# EAGLE design IceFeildBoard (EAGLE 8.6.0)
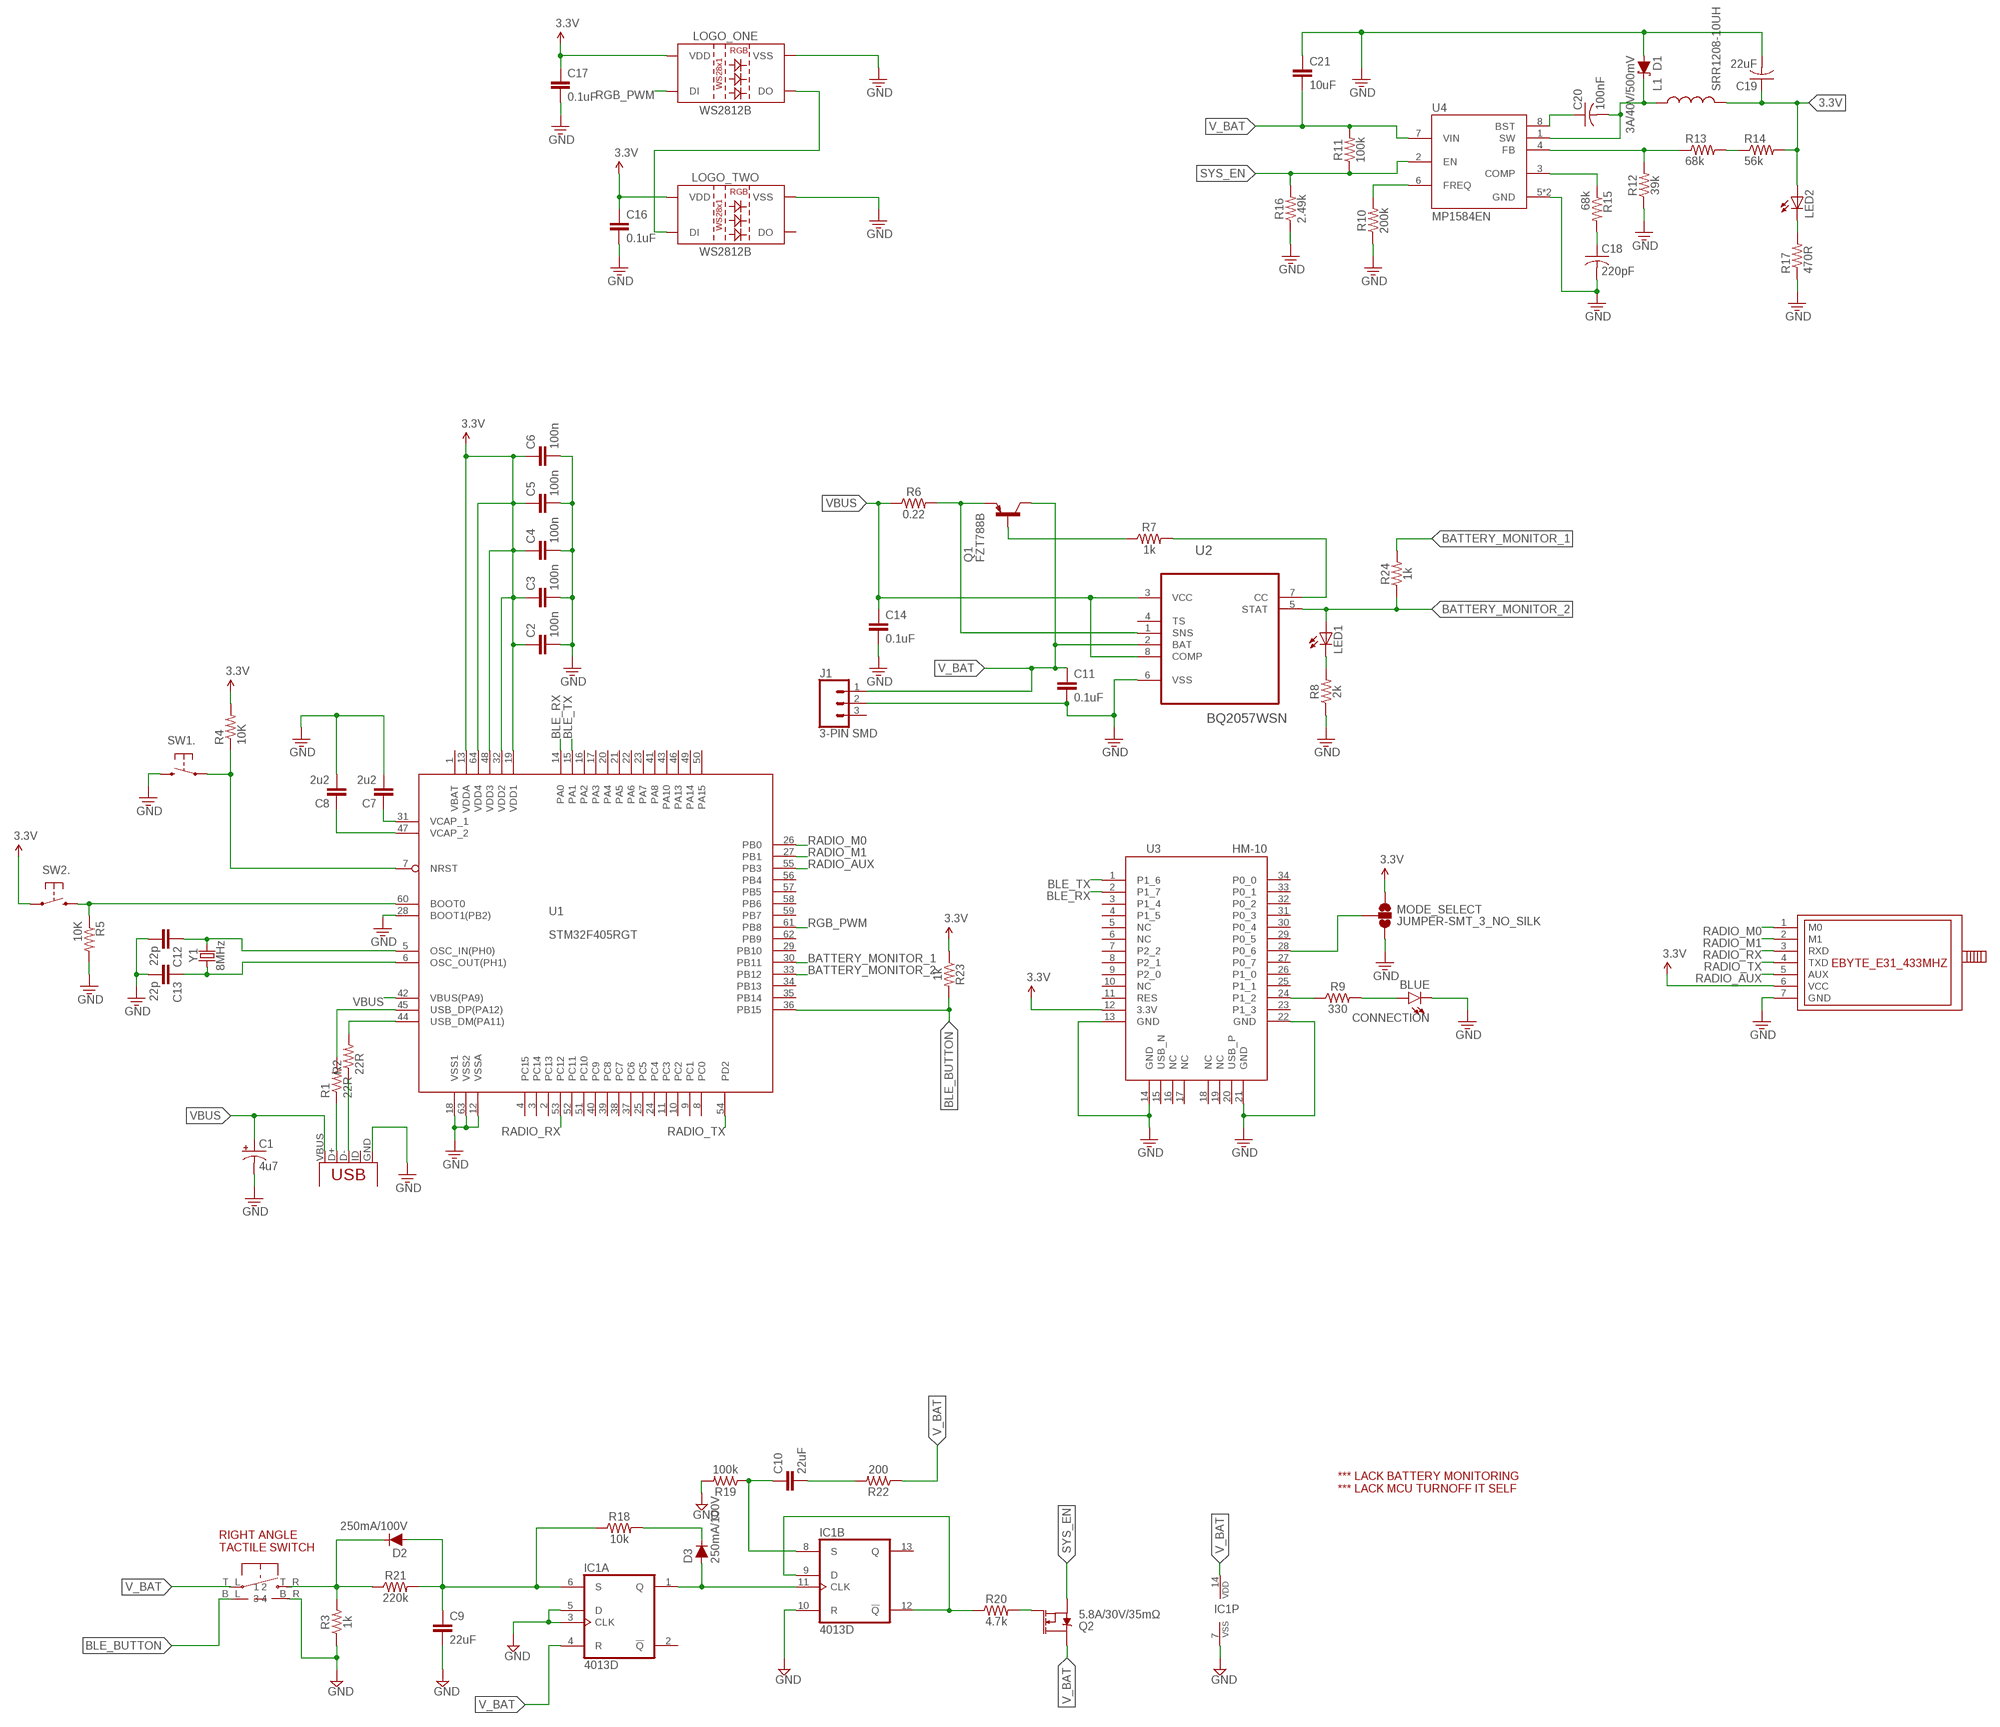
[diagram p0: schematic, sheet 1]

## Parts
C1  4u7  CAP_POL1206-KIT  [EIA3216-KIT]
C2  100n  CAP0603-CAP  [0603-CAP]
C3  100n  CAP0603-CAP  [0603-CAP]
C4  100n  CAP0603-CAP  [0603-CAP]
C5  100n  CAP0603-CAP  [0603-CAP]
C6  100n  CAP0603-CAP  [0603-CAP]
C7  2u2  CAP0603-CAP  [0603-CAP]
C8  2u2  CAP0603-CAP  [0603-CAP]
C9  22uF  22UF-0805-6.3V-20%  [0805]
C10  22uF  22UF-0805-6.3V-20%  [0805]
C11  0.1uF  0.1UF-0603-25V-(+80/-20%)  [0603]
C12  22p  CAP0603-CAP  [0603-CAP]
C13  22p  CAP0603-CAP  [0603-CAP]
C14  0.1uF  0.1UF-0603-25V-(+80/-20%)  [0603]
C16  0.1uF  0.1UF-0603-25V-5%  [0603]
C17  0.1uF  0.1UF-0603-25V-5%  [0603]
C18  220pF  C-USC0603  [C0603]
C19  22uF  C-USC0603  [C0603]
C20  100nF  C-USC0603  [C0603]
C21  10uF  10UF-0603-6.3V-20%  [0603]
CONNECTION  BLUE  LED-BLUE0603  [LED-0603]
D1  3A/40V/500mV  DIODE-SCHOTTKY-B340A  [SMA-DIODE]
D2  250mA/100V  DIODE-BAS16J  [SOD-323]
D3  250mA/100V  DIODE-BAS16J  [SOD-323]
IC1  4013D  [SO14]
J1  3-PIN SMD  CONN_03JST-SMD  [JST-3-SMD]
L1  SRR1208-10UH  [1008]
LED1  LED0603  [LED-0603]
LED2  LED0603  [LED-0603]
LOGO_ONE  WS2812B  [WS2812B]
LOGO_TWO  WS2812B  [WS2812B]
MODE_SELECT  JUMPER-SMT_3_NO_SILK  [SMT-JUMPER_3_NO_SILK]
Q1  FZT788B  [SOT230P700X180-4N]
Q2  5.8A/30V/35mΩ  MOSFET-NCH-AO3404A  [SOT23-3]
R1  22R  RESISTOR0603-RES  [0603-RES]
R2  22R  RESISTOR0603-RES  [0603-RES]
R3  1k  1KOHM-0603-1/10W-1%  [0603]
R4  10K  RESISTOR0603-RES  [0603-RES]
R5  10K  RESISTOR0603-RES  [0603-RES]
R6  0.22  0.22OHM-0805-1/4W-1%  [0805]
R7  1k  1KOHM-0603-1/10W-1%  [0603]
R8  2k  RESISTOR0603  [0603]
R9  330  330OHM-0603-1/10W-1%  [0603]
R10  200k  200KOHM-0603-1/10W-1%  [0603]
R11  100k  100KOHM-0603-1/10W-1%  [0603]
R12  39k  39KOHM-0603-1/10W-1%  [0603]
R13  68k  R-US_R0603  [R0603]
R14  56k  R-US_R0603  [R0603]
R15  68k  R-US_R0603  [R0603]
R16  2.49k  2.49KOHM-0603-1/10W-1%  [0603]
R17  470R  RESISTOR0603-RES  [0603-RES]
R18  10k  10KOHM-0603-1/10W-1%  [0603]
R19  100k  100KOHM-0603-1/10W-1%  [0603]
R20  4.7k  4.7KOHM-0603-1/10W-1%  [0603]
R21  220k  220KOHM-0603-1/10W-1%  [0603]
R22  200  200OHM-0603-1/10W-1%  [0603]
R23  1k  1KOHM-0603-1/10W-1%  [0603]
R24  1k  1KOHM-0603-1/10W-1%  [0603]
SW1  !RST  SWITCH-B3U-1110-BOSS  [SWITCH-TACT-B3U-1100P-B]
SW2  BOOT  SWITCH-B3U-1110-BOSS  [SWITCH-TACT-B3U-1100P-B]
U1  STM32F405RGT  [LQFP64]
U2  BQ2057WSN  [SOIC127P600X175-8N]
U3  HM-10  [HM-10]
U4  MP1584EN  [SOIC9P127_490X600X170L84X42T330X241N]
U$1  RIGHT_ANGLE_TACTILE_SWITCH  [RIGHT_ANGLE_TACTILE_SWITCH]
U$2  EBYTE_E31_433MHZ  [EBYTE_E31_433MHZ]
USB  USB-MICROB-SMD  [USB-MICROB-SMD]
Y1  8MHz  CRYSTAL-8MHZSMD-5X3.2  [CRYSTAL-SMD-5X3.2-4PAD]

## Nets
3.3V: C2.1 C3.1 C4.1 C5.1 C6.1 C16.1 C17.1 C19.1 L1.2 LED2.A LOGO_ONE.1(VDD) LOGO_TWO.1(VDD) MODE_SELECT.1 R4.2 R14.2 R23.1 SW2.1 U1.13(VDDA) U1.19(VDD1) U1.32(VDD2) U1.48(VDD3) U1.64(VDD4) U3.12(3.3V) U$2.6(VCC)
BATTERY_MONITOR_1 [Signal]: R24.2 U1.30(PB11)
BATTERY_MONITOR_2 [Signal]: LED1.A R24.1 U1.33(PB12) U2.5(STAT)
BLE_BUTTON: R23.2 U1.36(PB15) U$1.B_L
BLE_RX [Signal]: U1.14(PA0) U3.2(P1_7)
BLE_TX [Signal]: U1.15(PA1) U3.1(P1_6)
GND: C1.C(-) C2.2 C3.2 C4.2 C5.2 C6.2 C7.2 C8.2 C9.2 C11.2 C12.2 C13.2 C14.2 C16.2 C17.2 C18.2 C19.2 C21.1 CONNECTION.C D1.A IC1.3(A:CLK) IC1.5(A:D) IC1.7(P:VSS) IC1.10(B:R) J1.2 LOGO_ONE.3(VSS) LOGO_TWO.3(VSS) MODE_SELECT.3 R3.1 R5.2 R8.1 R10.1 R12.1 R16.1 R17.1 R19.2 SW1.2 U1.12(VSSA) U1.18(VSS1) U1.28(BOOT1(PB2)) U1.63(VSS2) U2.6(VSS) U3.13(GND) U3.14(GND) U3.21(GND) U3.22(GND) U4.5(GND) U4.9(GND) U$1.B_R U$2.7(GND) USB.GND
N$1: R1.2 U1.45(USB_DP(PA12))
N$2: R2.2 U1.44(USB_DM(PA11))
N$4 [Radio]: C14.1 R6.1 U2.3(VCC) U2.8(COMP)
N$5: R1.1 USB.D+
N$6: R2.1 USB.D-
N$7: CONNECTION.A R9.2
N$8: C9.1 D2.A IC1.6(A:S) R18.1 R21.2
N$9: R9.1 U3.24(P1_2)
N$10: MODE_SELECT.2 U3.28(P0_6)
N$11: LOGO_ONE.2(DO) LOGO_TWO.4(DI)
N$12: C13.1 U1.6(OSC_OUT(PH1)) Y1.1
N$13: C7.1 U1.31(VCAP_1)
N$14: C8.1 U1.47(VCAP_2)
N$15: C12.1 U1.5(OSC_IN(PH0)) Y1.3
N$16 [Signal]: R5.1 SW2.2 U1.60(BOOT0)
N$17 [Signal]: R4.1 SW1.1 U1.7(NRST)
N$18 [Radio]: Q1.3(E) R6.2 U2.1(SNS)
N$19 [Radio]: Q1.1(B) R7.1
N$20: R13.2 R14.1
N$21: D2.C R3.2 R21.1 U$1.T_R
N$22: R12.2 R13.1 U4.4(FB)
N$23 [Power]: C20.2 D1.C L1.1 U4.1(SW)
N$24 [Power]: C20.1 U4.8(BST)
N$25: LED2.C R17.2
N$26: D3.A IC1.1(A:Q) IC1.11(B:CLK)
N$27: D3.C R18.2
N$28: R15.1 U4.3(COMP)
N$29: C18.1 R15.2
N$30: IC1.9(B:D) IC1.12(B:!Q) R20.1
N$31: C10.1 IC1.8(B:S) R19.1
N$32: R10.2 U4.6(FREQ)
N$33: Q2.1(G) R20.2
N$34: R7.2 U2.7(CC)
N$35: C10.2 R22.2
N$37: LED1.C R8.2
RADIO_AUX: U1.55(PB3) U$2.5(AUX)
RADIO_M0: U1.26(PB0) U$2.1(M0)
RADIO_M1: U1.27(PB1) U$2.2(M1)
RADIO_RX: U1.53(PC12) U$2.3(RXD)
RADIO_TX: U1.54(PD2) U$2.4(TXD)
RGB_PWM [Signal]: LOGO_ONE.4(DI) U1.61(PB8)
SYS_EN: Q2.2(S) R11.1 R16.2 U4.2(EN)
V_BAT: C11.1 C21.2 IC1.4(A:R) IC1.14(P:VDD) J1.1 Q1.2(C) Q1.4(C) Q2.3(D) R11.2 R22.1 U2.2(BAT) U4.7(VIN) U$1.T_L
VBUS: C1.A(+) U1.42(VBUS(PA9)) USB.VBUS
Unconnected: IC1.2(A:!Q) IC1.13(B:Q) J1.3 LOGO_TWO.2(DO) SW1.BOSS SW2.BOSS U1.2(PC13) U1.3(PC14) U1.4(PC15) U1.8(PC0) U1.9(PC1) U1.10(PC2) U1.11(PC3) U1.16(PA2) U1.17(PA3) U1.20(PA4) U1.21(PA5) U1.22(PA6) U1.23(PA7) U1.24(PC4) U1.25(PC5) U1.29(PB10) U1.34(PB13) U1.35(PB14) U1.37(PC6) U1.38(PC7) U1.39(PC8) U1.40(PC9) U1.41(PA8) U1.43(PA10) U1.46(PA13) U1.49(PA14) U1.50(PA15) U1.51(PC10) U1.52(PC11) U1.56(PB4) U1.57(PB5) U1.58(PB6) U1.59(PB7) U1.62(PB9) U2.4(TS) U3.3(P1_4) U3.4(P1_5) U3.5(NC) U3.6(NC) U3.7(P2_2) U3.8(P2_1) U3.9(P2_0) U3.10(NC) U3.11(RES) U3.15(USB_N) U3.16(NC) U3.17(NC) U3.18(NC) U3.19(NC) U3.20(USB_P) U3.23(P1_3) U3.25(P1_1) U3.26(P1_0) U3.27(P0_7) U3.29(P0_5) U3.30(P0_4) U3.31(P0_3) U3.32(P0_2) U3.33(P0_1) U3.34(P0_0) USB.ID USB.MT1 USB.MT2 USB.MT3 USB.MT4

## Notes on the sheet
- *** LACK BATTERY MONITORING 
  *** LACK MCU TURNOFF IT SELF

## Power pins joined to a net without a drawn wire
VBAT: U1.1(VBAT)

## Library data of the parts
C1 = stm32f4stamp:CAP_POL: Capacitor Polarized These are standard SMD and PTH capacitors. Normally 10uF, 47uF, and 100uF in electrolytic and tantalum varieties. Always verify the external diameter of the through hole cap, it varies with capacity, voltage, and manufacturer. The EIA devices should be standard.; OC_NEWARK: unknown
C2-C8 C12 C13 = stm32f4stamp:CAP: Capacitor Standard 0603 ceramic capacitor, and 0.1" leaded capacitor.; OC_NEWARK: unknown
C9 C10 = SparkFun-Capacitors:22UF: 22µF ceramic capacitors A capacitor is a passive two-terminal electrical component used to store electrical energy temporarily in an electric field.; OC_NEWARK: unknown; PROD_ID: CAP-08402
C11 C14 = SparkFun-Capacitors:0.1UF: 0.1µF ceramic capacitors A capacitor is a passive two-terminal electrical component used to store electrical energy temporarily in an electric field.; OC_NEWARK: unknown; PROD_ID: CAP-00810
C16 C17 = SparkFun-Capacitors:0.1UF: 0.1µF ceramic capacitors A capacitor is a passive two-terminal electrical component used to store electrical energy temporarily in an electric field.; OC_NEWARK: unknown; PROD_ID: CAP-08604
C18-C20 = adafruit:C-US: CAPACITOR, American symbol; OC_NEWARK: unknown
C21 = SparkFun-Capacitors:10UF: 10.0µF ceramic capacitors A capacitor is a passive two-terminal electrical component used to store electrical energy temporarily in an electric field.; OC_NEWARK: unknown; PROD_ID: CAP-11015
CONNECTION = SparkFun-LED:LED-BLUE: Blue SMD LED Used in manufacturing of various products at SparkFun Packages: 0603 - SMD 0603 package [Product Link] <http://www.digikey.com/product-detail/en/SMLE12BC7TT86/511-1589-2-ND/1641808> 1206 - SMD1206 package [Product Link] <http://www.digikey.com/product-detail/en/lite-on-inc/LTST-C150TBKT/160-1643-1-ND/573584> SparkFun Products: ESP8266 Thing-Dev Board <https://www.sparkfun.com/products/13711> RedBoard <https://www.sparkfun.com/products/12757>; OC_NEWARK: unknown; PROD_ID: DIO-08575
D1 = SparkFun-DiscreteSemi:DIODE-SCHOTTKY: Schottky diode A Schottky diode is a semiconductor diode which has a low forward voltage drop and a very fast switching action.; OC_NEWARK: unknown; PROD_ID: DIO-09886
D2 D3 = SparkFun-DiscreteSemi:DIODE: Diode These are standard reverse protection diodes and small signal diodes. SparkFun Products: SparkFun SparkPunk Sound Kit <https://www.sparkfun.com/products/11177> SparkFun ESP8266 Thing <https://www.sparkfun.com/products/13231>; OC_NEWARK: unknown; PROD_ID: DIO-09646
IC1 = 40xx:4013: Dual D FLIP FLOP, set/reset; OC_NEWARK: unknown
J1 = SparkFun-Connectors:CONN_03: Multi connection point. Often used as Generic Header-pin footprint for 0.1 inch spaced/style header connections On any of the 0.1 inch spaced packages, you can populate with these: Break Away Headers - Straight <https://www.sparkfun.com/products/116> (PRT-00116) Break Away Male Headers - Right Angle <https://www.sparkfun.com/products/553> (PRT-00553) Female Headers <https://www.sparkfun.com/products/115> (PRT-00115) Break Away Headers - Machine Pin <https://www.sparkfun.com/products/117> (PRT-00117) Break Away Female Headers - Swiss Machine Pin <https://www.sparkfun.com/products/743> (PRT-00743) Stackable Header - 3 Pin (Female, 0.1") <https://www.sparkfun.com/products/13875> (PRT-13875) For SCREWTERMINALS and SPRING TERMINALS visit here: Screw Terimnals on SparkFun.com <https://www.sparkfun.com/search/results?term=Screw+Terminals> (5mm/3.5mm/2.54mm spacing) This device is also useful as a general connection point to wire up your design to another part of your project. Our various solder wires solder well into these plated through hole pads. Hook-Up Wire - Assortment (Stranded, 22 AWG) <https://www.sparkfun.com/products/11375> (PRT-11375) Hook-Up Wire - Assortment (Solid Core, 22 AWG) <https://www.sparkfun.com/products/11367> (PRT-11367) View the entire wire category on our website here <https://www.sparkfun.com/categories/141> Special notes: Molex polarized connector foot print use with SKU : PRT-08232 with associated crimp pins and housings.; OC_NEWARK: unknown; PROD_ID: CONN-12591
L1 = 1008:SRR1208-10UH; OC_NEWARK: unknown
LED1 LED2 = stm32f4stamp:LED: LEDs Standard schematic elements and footprints for 5mm, 3mm, 1206, and 0603 sized LEDs. 5mm - Spark Fun Electronics SKU : COM-00529 (and others); OC_NEWARK: unknown
LOGO_ONE LOGO_TWO = SparkFun-LED:WS2812B: WS2812B SMD addressable RGB LED 5x5mm SMD LED with built-in controller IC. Color: Red/Green/Blue mC Rating: RGB: 390, 660, 180 mcd Forward Voltage: RGB: 2.0, 3.0, 3.0 V Packages:WS2812B SparkFun Products: Blynk Board - ESP8266 <https://www.sparkfun.com/products/13794>; OC_NEWARK: unknown; PROD_ID: DIO-12503
MODE_SELECT = SparkFun-Jumpers:JUMPER-SMT_3_NO: Normally open jumper This jumper has three pads in close proximity to each other. Apply solder to close the connection(s).; OC_NEWARK: unknown
Q1 = FZT788B:FZT788B; OC_NEWARK: unknown
Q2 = SparkFun-DiscreteSemi:MOSFET-NCH: N-channel MOSFETs Voltage controlled devices that allow control of high current outputs. SparkFun Products: SparkFun OpenScale <https://www.sparkfun.com/products/13261> SparkFun Digital Sandbox <https://www.sparkfun.com/products/12651> SparkFun Monster Moto Shield <https://www.sparkfun.com/products/10182> SparkFun MOSFET Power Controller <https://www.sparkfun.com/products/11214>; OC_NEWARK: unknown; PROD_ID: TRANS-12988
R1 R2 R4 R5 R17 = stm32f4stamp:RESISTOR: Resistor Basic schematic elements and footprints for 0603, 1206, and PTH resistors.; OC_NEWARK: unknown
R3 R7 R23 R24 = SparkFun-Resistors:1KOHM: 1kΩ resistor A resistor is a passive two-terminal electrical component that implements electrical resistance as a circuit element. Resistors act to reduce current flow, and, at the same time, act to lower voltage levels within circuits. - Wikipedia; OC_NEWARK: unknown; PROD_ID: RES-07856
R6 = SparkFun-Resistors:0.22OHM: 0.22Ω resistor A resistor is a passive two-terminal electrical component that implements electrical resistance as a circuit element. Resistors act to reduce current flow, and, at the same time, act to lower voltage levels within circuits. - Wikipedia; OC_NEWARK: unknown; PROD_ID: RES-09883
R8 = SparkFun-Resistors:RESISTOR: Generic Resistor Package; OC_NEWARK: unknown
R9 = SparkFun-Resistors:330OHM: 330Ω resistor A resistor is a passive two-terminal electrical component that implements electrical resistance as a circuit element. Resistors act to reduce current flow, and, at the same time, act to lower voltage levels within circuits. - Wikipedia; OC_NEWARK: unknown; PROD_ID: RES-00818
R10 = SparkFun-Resistors:200KOHM: 200kΩ resistor A resistor is a passive two-terminal electrical component that implements electrical resistance as a circuit element. Resistors act to reduce current flow, and, at the same time, act to lower voltage levels within circuits. - Wikipedia; OC_NEWARK: unknown; PROD_ID: RES-09385
R11 R19 = SparkFun-Resistors:100KOHM: 100kΩ resistor A resistor is a passive two-terminal electrical component that implements electrical resistance as a circuit element. Resistors act to reduce current flow, and, at the same time, act to lower voltage levels within circuits. - Wikipedia; OC_NEWARK: unknown; PROD_ID: RES-07828
R12 = SparkFun-Resistors:39KOHM: 39kΩ resistor A resistor is a passive two-terminal electrical component that implements electrical resistance as a circuit element. Resistors act to reduce current flow, and, at the same time, act to lower voltage levels within circuits. - Wikipedia; OC_NEWARK: unknown; PROD_ID: RES-12377
R13-R15 = adafruit:R-US_: RESISTOR, American symbol; OC_NEWARK: unknown
R16 = SparkFun-Resistors:2.49KOHM: 2.49kΩ resistor A resistor is a passive two-terminal electrical component that implements electrical resistance as a circuit element. Resistors act to reduce current flow, and, at the same time, act to lower voltage levels within circuits. - Wikipedia; OC_NEWARK: unknown; PROD_ID: RES-09568
R18 = SparkFun-Resistors:10KOHM: 10kΩ resistor A resistor is a passive two-terminal electrical component that implements electrical resistance as a circuit element. Resistors act to reduce current flow, and, at the same time, act to lower voltage levels within circuits. - Wikipedia; OC_NEWARK: unknown; PROD_ID: RES-00824
R20 = SparkFun-Resistors:4.7KOHM: 4.7kΩ resistor A resistor is a passive two-terminal electrical component that implements electrical resistance as a circuit element. Resistors act to reduce current flow, and, at the same time, act to lower voltage levels within circuits. - Wikipedia; OC_NEWARK: unknown; PROD_ID: RES-07857
R21 = SparkFun-Resistors:220KOHM: 220kΩ resistor A resistor is a passive two-terminal electrical component that implements electrical resistance as a circuit element. Resistors act to reduce current flow, and, at the same time, act to lower voltage levels within circuits. - Wikipedia; OC_NEWARK: unknown; PROD_ID: RES-08969
R22 = SparkFun-Resistors:200OHM: 200Ω resistor A resistor is a passive two-terminal electrical component that implements electrical resistance as a circuit element. Resistors act to reduce current flow, and, at the same time, act to lower voltage levels within circuits. - Wikipedia; OC_NEWARK: unknown; PROD_ID: RES-08220
SW1 SW2 = stm32f4stamp:SWITCH-B3U-1110; OC_NEWARK: unknown
U1 = stm32f4stamp:STM32F405RGT; OC_NEWARK: unknown
U2 = BQ2057WSN:BQ2057WSN: Charge management IC; AVAILABILITY: Good; DESCRIPTION: Low Dropout Linear 2-cell Li-Ion Charge Controller with AutoCompTM, 8.4V 8-SOIC -20 to 70; MP: BQ2057WSN; OC_NEWARK: unknown; PACKAGE: SOIC-8 Texas Instruments; PRICE: 1.54 USD
U3 = HM-10:HM-10; OC_NEWARK: unknown
U4 = MP1584EN:MP1584EN: 3A, 1.5MHz, 28V Step-Down Converter; AVAILABILITY: Unavailable; MP: MP1584EN; OC_NEWARK: unknown; PACKAGE: None; PRICE: None
U$1 = KevinMade:RIGHT_ANGLE_TACTILE_SWITCH; OC_NEWARK: unknown
U$2 = KevinMade:EBYTE_E31_433MHZ; OC_NEWARK: unknown
USB = stm32f4stamp:USB: USB Connectors USB-B-PTH is fully proven SKU : PRT-00139 USB-miniB is fully proven SKU : PRT-00587 USB-A-PCB is untested. USB-A-H is throughly reviewed, but untested. Spark Fun Electronics SKU : PRT-00437 USB-B-SMT is throughly reviewed, but untested. Needs silkscreen touching up. USB-A-S has not been used/tested USB-MB-H has not been used/tested; OC_NEWARK: unknown
Y1 = SparkFun-Clocks:CRYSTAL-8MHZ: 8MHz Crystal Datasheet Example <http://www.futureelectronics.com/en/technologies/electromechanical/timing-devices/crystals/Pages/6008189-ABM3B-8.000MHZ-B2-T.aspx?IM=0> Frequency: 8MHz Frequency Tolerance: ±20ppm Load Capacitance: 18pF SparkFun Products: Pro Micro -3.3V/8MHz <https://www.sparkfun.com/products/12587> WAV Trigger <https://www.sparkfun.com/products/13660>; OC_NEWARK: unknown; PROD_ID: XTAL-09431

## Net classes
0 default: width 0.254 mm, drill 0.305 mm, clearance 0.152 mm
1 Radio: width 0.762 mm, drill 0.762 mm, clearance 0.254 mm
2 Power: width 1.016 mm, drill 1.016 mm, clearance 0.381 mm
3 Signal: width 0.152 mm, drill 0.305 mm, clearance 0.152 mm

## Board
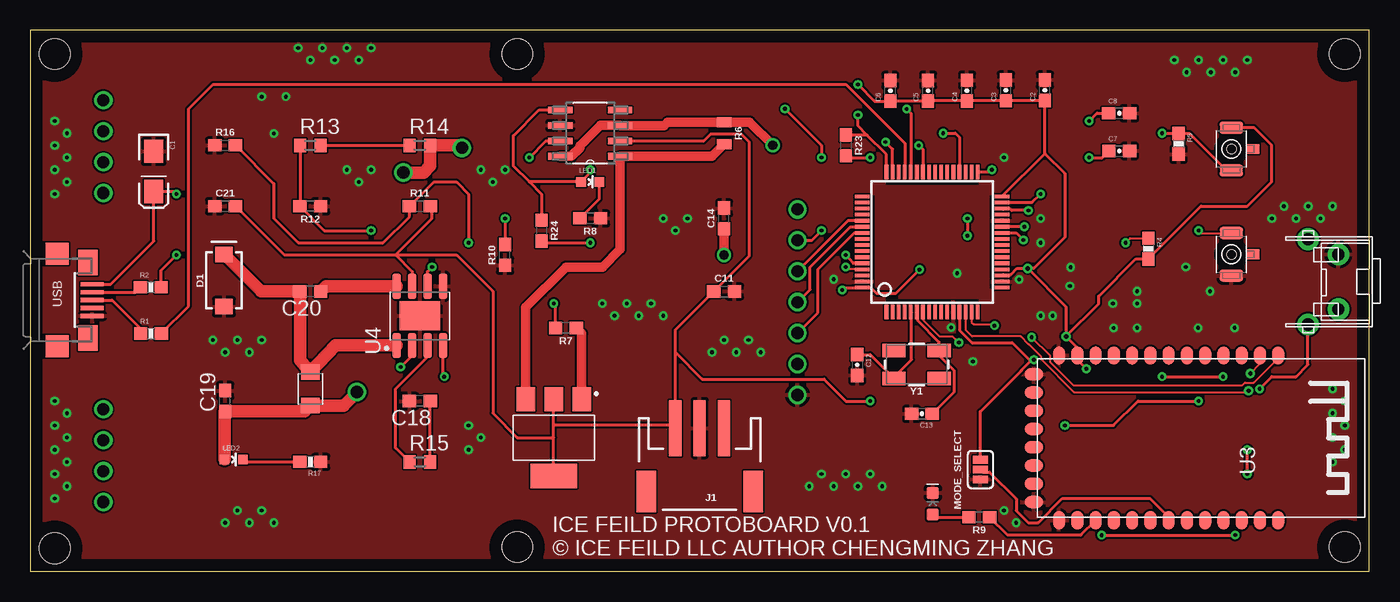
[diagram p1: board, top side]
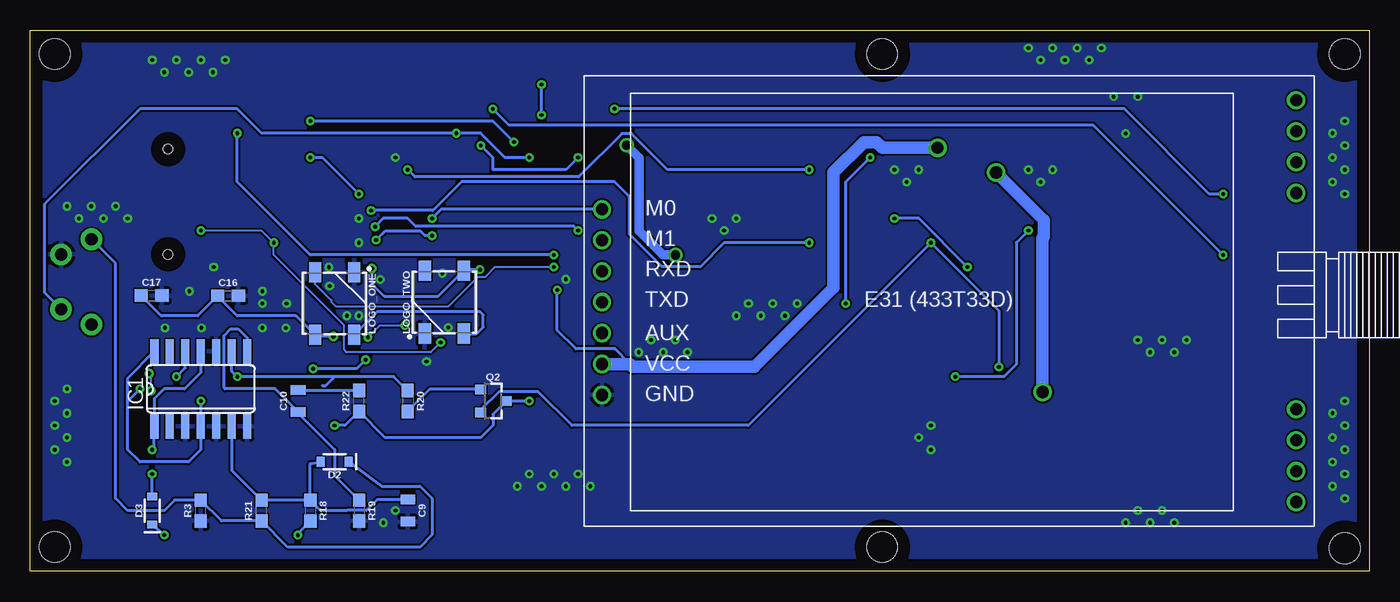
[diagram p2: board, bottom side, seen from below]

Size 110 x 44.44 mm. Coordinates in mm from the lower left corner, seen from the top.
Outline: 0,0 110,0 110,44.44 0,44.44 0,0
Copper layers (1*16): Top 0.035mm / dielectric 1.5mm / Bottom 0.035mm
Design rules "default": minimum track width 6mil, minimum drill 0.35mm, track to track 6mil, track to pad 6mil, pad to pad 6mil, via to via 6mil, smd to smd 6mil, copper to edge 40mil, drill to drill 6mil, minimum pad ring 10mil, minimum via ring 8mil, stop-mask expansion 4mil, vias tented up to drill 0mil, thermal gap 10mil
Holes 2.5 mm at 2,42.5 2,1.9 108,42.5 108,2 40,42.5 40,2

### Footprints (pad centres in the part's own frame; a part is rotated, then mirrored left to right if it is on the bottom)
EIA3216-KIT = smd 1.9 x 1.6: A 1.65,0; C -1.65,0
0603-CAP = smd 1.1 x 1: 1 -0.85,0; 2 0.85,0
0805 = smd 0.8 x 1.2: 1 -0.9,0; 2 0.9,0
0603 = smd 1.1 x 1: 1 -0.85,0; 2 0.85,0
C0603 = smd 1.1 x 1: 1 -0.85,0; 2 0.85,0
LED-0603 = smd 1 x 1: A -0.877,0; C 0.877,0
SMA-DIODE = smd 1.27 x 1.47: A -2.15,0; C 2.15,0
SOD-323 = smd 0.63 x 0.83: A 1.15,0; C -1.15,0
SO14 = smd 0.66 x 2.032: 1 -3.81,-3.073; 2 -2.54,-3.073; 3 -1.27,-3.073; 4 0,-3.073; 5 1.27,-3.073; 6 2.54,-3.073; 7 3.81,-3.073; 8 3.81,3.073; 9 2.54,3.073; 10 1.27,3.073; 11 0,3.073; 12 -1.27,3.073; 13 -2.54,3.073; 14 -3.81,3.073
JST-3-SMD = smd 1 x 4.6: 1 2.01,-4.77; 2 0.01,-4.77; 3 -1.99,-4.77 | smd 1.6 x 3.4: NC1 -4.39,0.43; NC2 4.41,0.43
1008 = smd 1.25 x 1.5: 1 -1.375,0; 2 1.375,0
LED-0603' = smd 0.8 x 0.8: A 0,-0.75; C 0,0.75
WS2812B = smd 1.651 x 1: 1 2.577,-1.6; 2 2.577,1.6; 3 -2.577,1.6; 4 -2.577,-1.6
SMT-JUMPER_3_NO_SILK = smd 0.635 x 1.27: 1 -0.813,0; 2 0,0; 3 0.813,0
SOT230P700X180-4N = smd 1.5 x 2: 1 -2.3,-3.15; 2 0,-3.15; 3 2.3,-3.15 | smd 3.8 x 2: 4 0,3.15
SOT23-3 = smd 0.8 x 0.9: 1 -0.95,-1; 2 0.95,-1; 3 0,1.1
0603-RES = smd 1.1 x 1: 1 -0.85,0; 2 0.85,0
R0603 = smd 1 x 1.1: 1 -0.85,0; 2 0.85,0
SWITCH-TACT-B3U-1100P-B = smd 1 x 1.9: 1 -1.75,0; 2 1.75,0 | smd 0.8 x 1.1: BOSS 0,1.75 | hole 0.762: 0,0
LQFP64 = smd 0.3 x 1.2: 1 -3.75,-5.75; 2 -3.25,-5.75; 3 -2.75,-5.75; 4 -2.25,-5.75; 5 -1.75,-5.75; 6 -1.25,-5.75; 7 -0.75,-5.75; 8 -0.25,-5.75; 9 0.25,-5.75; 10 0.75,-5.75; 11 1.25,-5.75; 12 1.75,-5.75; 13 2.25,-5.75; 14 2.75,-5.75; 15 3.25,-5.75; 16 3.75,-5.75; 33 3.75,5.75; 34 3.25,5.75; 35 2.75,5.75; 36 2.25,5.75; 37 1.75,5.75; 38 1.25,5.75; 39 0.75,5.75; 40 0.25,5.75; 41 -0.25,5.75; 42 -0.75,5.75; 43 -1.25,5.75; 44 -1.75,5.75; 45 -2.25,5.75; 46 -2.75,5.75; 47 -3.25,5.75; 48 -3.75,5.75 | smd 1.2 x 0.3: 17 5.75,-3.75; 18 5.75,-3.25; 19 5.75,-2.75; 20 5.75,-2.25; 21 5.75,-1.75; 22 5.75,-1.25; 23 5.75,-0.75; 24 5.75,-0.25; 25 5.75,0.25; 26 5.75,0.75; 27 5.75,1.25; 28 5.75,1.75; 29 5.75,2.25; 30 5.75,2.75; 31 5.75,3.25; 32 5.75,3.75; 49 -5.75,3.75; 50 -5.75,3.25; 51 -5.75,2.75; 52 -5.75,2.25; 53 -5.75,1.75; 54 -5.75,1.25; 55 -5.75,0.75; 56 -5.75,0.25; 57 -5.75,-0.25; 58 -5.75,-0.75; 59 -5.75,-1.25; 60 -5.75,-1.75; 61 -5.75,-2.25; 62 -5.75,-2.75; 63 -5.75,-3.25; 64 -5.75,-3.75
SOIC127P600X175-8N = smd 1.981 x 0.559: 1 -2.464,1.905; 2 -2.464,0.635; 3 -2.464,-0.635; 4 -2.464,-1.905; 5 2.464,-1.905; 6 2.464,-0.635; 7 2.464,0.635; 8 2.464,1.905
HM-10 = smd 1.5 x 1: 1 -6.77,6.35; 2 -6.77,4.85; 3 -6.77,3.35; 4 -6.77,1.85; 5 -6.77,0.35; 6 -6.77,-1.15; 7 -6.77,-2.65; 8 -6.77,-4.15; 9 -6.77,-5.65; 10 -6.77,-7.15; 11 -6.77,-8.65; 12 -6.77,-10.15; 13 -6.77,-11.65; 22 6.77,-11.65; 23 6.77,-10.15; 24 6.77,-8.65; 25 6.77,-7.15; 26 6.77,-5.65; 27 6.77,-4.15; 28 6.77,-2.65; 29 6.77,-1.15; 30 6.77,0.35; 31 6.77,1.85; 32 6.77,3.35; 33 6.77,4.85; 34 6.77,6.35 | smd 1 x 1.5: 14 -5.23,-13.72; 15 -3.73,-13.72; 16 -2.23,-13.72; 17 -0.73,-13.72; 18 0.77,-13.72; 19 2.27,-13.72; 20 3.77,-13.72; 21 5.27,-13.72
SOIC9P127_490X600X170L84X42T330X241N = smd 2.05 x 0.66: 1 -2.43,1.905; 2 -2.43,0.635; 3 -2.43,-0.635; 4 -2.43,-1.905; 5 2.43,-1.905; 6 2.43,-0.635; 7 2.43,0.635; 8 2.43,1.905 | smd 2.41 x 3.3: 9 0,0
RIGHT_ANGLE_TACTILE_SWITCH = drill 1 pad 1.778: B_L -2.25,0; B_R 2.25,0; T_L -3.5,2.5; T_R 3.5,2.5
EBYTE_E31_433MHZ = drill 1: 1 1.48,26.04; 2 1.48,23.5; 3 1.48,20.96; 4 1.48,18.42; 5 1.48,15.88; 6 1.48,13.34; 7 1.48,10.8; P$8 58.52,2; P$9 58.52,4.54; P$10 58.52,7.08; P$11 58.52,9.62; P$12 58.52,35; P$13 58.52,32.46; P$14 58.52,29.92; P$15 58.52,27.38
USB-MICROB-SMD = smd 0.35 x 1.9: D+ 0,2.9; D- -0.65,2.9; GND 1.3,2.9; ID 0.65,2.9; VBUS -1.3,2.9 | smd 1.8 x 1.9: MT1 -3.8,0; MT2 3.8,0 | smd 2.1 x 1.6: MT3 -3.1,2.55; MT4 3.1,2.55
CRYSTAL-SMD-5X3.2-4PAD = smd 1.9 x 1.1: 1 -1.85,-1.15; 2 1.85,-1.15; 3 1.85,1.15; 4 -1.85,1.15

### Placement (x,y rotation side)
C1  10.13,32.86 270 top
C2  83.36,39.52 90 top
C3  80.16,39.51 90 top
C4  76.96,39.5 90 top
C5  73.76,39.49 90 top
C6  70.66,39.48 90 top
C7  89.47,34.54 0 top
C8  89.46,37.64 0 top
C9  79,5 270 bottom
C10  88,14 90 bottom
C11  57,23 0 top
C12  67.94,16.96 270 top
C13  73.26,12.94 180 top
C14  57,29 90 top
C16  93.76,22.64 0 bottom
C17  100.05,22.66 0 bottom
C18  32,14 180 top
C19  16,14 90 top
C20  23,23 180 top
C21  16,30 0 top
CONNECTION  74.15,5.57 90 top
D1  15.9,23.9 90 top
D2  85,9 180 bottom
D3  100,5 90 bottom
IC1  96,15 0 bottom
J1  55,7 180 top
L1  23,15 270 top
LED1  [LED-0603']  46,32 270 top
LED2  [LED-0603']  16.7,9.2 270 top
LOGO_ONE  85.01,22.01 270 bottom
LOGO_TWO  75.99,22.12 90 bottom
MODE_SELECT  78.06,8.37 270 top
Q1  43,11 180 top
Q2  72,14 270 bottom
R1  9.91,19.55 0 top
R2  9.9,23.35 0 top
R3  96,5 90 bottom
R4  91.85,26.52 270 top
R5  94.35,35.13 270 top
R6  57,36 270 top
R7  44,20 180 top
R8  46,29 180 top
R9  77.97,4.46 180 top
R10  39,26 90 top
R11  32,30 0 top
R12  23,30 180 top
R13  23,35 0 top
R14  32,35 0 top
R15  32,9 0 top
R16  16,35 0 top
R17  23,9 180 top
R18  87,5 270 bottom
R19  83,5 270 bottom
R20  79,14 270 bottom
R21  91,5 90 bottom
R22  83,14 90 bottom
R23  67,35 270 top
R24  42,28 270 top
SW1  98.68,26.05 270 top
SW2  98.68,34.7 270 top
U1  74.09,27.06 0 top
U2  46,36 180 top
U3  96.18,10.97 270 top
U4  32,21 90 top
U$1  107.48,23.79 90 top
U$2  64.51,3.7 0 bottom
USB  2.19,22.29 270 top
Y1  72.82,17.01 180 top

### Tracks (layer width: path | path; a pad name or v marks a point on that pad's centre or on a via)
3.3V  (via drill 0.3, 0.35, 1.02)
  Top 0.254: LED2.A 16,9.25 | U1.48 70.34,34.26 68.75,35.85 | 68.75,35.85 R23.1 | C6.1 C5.1 C4.1 C3.1 C2.1 83.36,34.33 | C6.1 | 68.75,35.85 68,36.6 v68,37.5 | v68,40 69.36,38.64 C6.1 | SW2.1 100.55,36.45 102,35 102,32 100,30 96.18,30 R4.2 90.85,25.67 87.79,22.61 87.79,22 v85.1,19.3 | v66.71,23.11 66.9,23.31 U1.64 69.05,23.31 69.5,22.86 71.13,22.86 v73.06,24.79 | U1.13 76.34,19.83 77.38,18.8 80.68,18.8 82.08,17.39 v82.46,17.39 82.3,17.39 81.43,16.53 81.43,16.5 78.06,13.13 MODE_SELECT.1 | 86.03,17.18 86.03,17.4 | 86.03,17.4 U3.12 86.03,18.37 v85.1,19.3 | U1.19 79.91,24.38 80.56,24.38 81.07,24.89 v81.95,24.89 | U1.32 83.36,34.33 | 83.36,34.33 85,32.69 85,27.43 82.46,24.89 v81.95,24.89 | v86.77,16.66 86.03,17.4 | v81.95,24.89 85.1,21.74 v85.1,19.3
  Top 1.016: LED2.A 15.95,13.1 C19.1 22.52,13.15 L1.2 25.72,13.62 v26.83,14.73 | v30.64,32.77 32.29,32.77 32.85,33.32 R14.2 35.26,35 v35.47,34.8
  Bottom 0.254: v68,37.5 v68,40 | C17.1 99.24,21 96.25,21 C16.1 94.61,22.61 93,21 88.18,21 LOGO_ONE.1 86.48,19.3 v85.1,19.3 | 60.73,17.04 61.98,18.29 65.18,18.29 66.71,19.81 v66.71,23.11 | v73.06,24.79 74.3,24.79 LOGO_TWO.1 76.48,22.61 80.93,22.61 81.95,23.62 v81.95,24.89 | v82.46,17.39 83.19,16.66 v86.77,16.66
  Bottom 1.016: v26.83,14.73 26.83,27.38 26.73,27.48 26.73,28.86 v30.64,32.77 | U$2.6 60.73,17.04 60.49,16.81 50.51,16.81 44.02,23.3 44.02,32.78 41.52,35.27 40.48,35.27 40.01,34.8 v35.47,34.8
BATTERY_MONITOR_1  (via drill 0.3)
  Top 0.254: R24.2 42.15,27 v46,27 | v82,29.65 80.64,29.65 80.56,29.74 79.91,29.74 U1.30
  Bottom 0.254: v46,27 53,27 55,25 55.03,25.04 58.11,25.04 60.76,27.68 60.76,30.76 62,32 74.58,32 76.92,29.65 v82,29.65
BATTERY_MONITOR_2  (via drill 0.3)
  Top 0.254: 41,32 LED1.A 46,32.75 v46,33 | 41,32 39.7,33.3 39.7,35.8 41.8,37.91 U2.5 | 41,32 42,31 R24.1 | v79,33 78.81,32.81 U1.33
  Bottom 0.254: v46,33 57.64,33 60.6,35.97 61.4,35.97 64.96,32.41 78.41,32.41 v79,33
BLE_BUTTON  (via drill 0.3)
  Top 0.254: R23.2 67.15,34 v69,34 | v75,36 76,36 76.34,35.66 U1.36
  Bottom 0.254: v69,34 71,34 73,36 v75,36 91,36 93,38 101,38 108.86,30.14 108.86,22.92 U$1.B_L
BLE_RX  (via drill 0.35)
  Top 0.152: U1.14 76.84,19.84 77.38,19.3 81.37,19.3 82.02,18.66 82.05,18.66 83.06,17.64 83.06,17.43 85.76,14.73 99.98,14.73 v100.09,14.84 | v100.24,16.26 101.03,17.05 U3.2
  Bottom 0.152: v100.09,14.84 100.09,16.11 v100.24,16.26
BLE_TX  (via drill 0.3)
  Top 0.152: U1.15 77.34,20.49 77.53,20.3 79.11,20.3 v79.22,20.19 | U3.1 102.53,17.53 100.51,15.51 99.79,15.51 99.59,15.3 85.68,15.3 83.8,17.18 83.8,17.7 v82.26,19.24
  Bottom 0.152: v79.22,20.19 81.32,20.19 v82.26,19.25 v82.26,19.24
GND  (via drill 0.3)
  other vias: 66,24 83,29 83,27 80,34 77.44,17.25 89,20 88.94,22.01 90.94,23.01 90.94,22.01 90.94,20.01 95.94,20.01 98.94,20.01 96.94,23.01 94.94,25.01 65,8 57,19 58,18 70,7 2,14 3,13 2,12 3,11 2,10 3,9 2,8 3,7 2,6 2,31 3,32 2,33 3,34 2,35 3,36 2,37 22,43 23,42 24,43 25,42 26,43 27,42 28,43 36,12 37,11 36,10 17,19 19,19 18,18 16,18 15,19 49,22 51,22 50,21 48,21 47,22 52,21 52,29 53,28 54,29 37,33 39,33 38,32 26,33 28,33 27,32 19,39 21,39 20,35.97 94,42 96,42 95,41 97,41 98,42 99,41 100,42 103,30 102,29 104,29 105,30 106,29 107,30 107,15 108,14 107,13 108,12 107,11 108,10 107,9 64,7 66,7 67,8 68,7 69,8 59,19 60,18 56,18 16,4 17,5 18,4 19,5 20,4 81.24,23.98 85.47,24.99 85.41,23.45 83,21 84,21 80,5 81,4 75.67,20.05 76.16,24.49
  pour Top: -2,46 -2,-2 112,-2 112,45 111,46
  pour Bottom: -1,45 -1,-2 112,-2 112,45
N$1
  Top 0.254: R1.2 13,21.79 13,38 15,40 67,40 71.84,35.16 U1.45
N$2  (via drill 0.3)
  Top 0.254: R2.2 10.75,24.75 v12,26 | v72,37.98 72.34,37.64 U1.44
  Bottom 0.254: v12,26 22.66,36.66 70.68,36.66 v72,37.98
N$4  (via drill 0.76)
  Top 0.762: U2.8 44.43,34.09 45.16,34.82 45.16,34.96 46.84,36.63 U2.3 48.48,36.62 52.08,36.62 52.36,36.9 R6.1 59.1,36.9 v61,35 | v57,26 C14.1
  Bottom 0.762: v61,35 60,34 60,28 58,26 v57,26
N$5
  Top 0.254: USB.D+ 6.71,22.29 9.06,19.94 R1.1
N$6
  Top 0.254: USB.D- 8.64,22.94 R2.1
N$7
  Top 0.254: CONNECTION.A 74.38,4.46 R9.2
N$8
  Bottom 0.254: C9.1 81.5,5.9 82.38,5.02 83.98,5.02 84,5 86.15,5 R18.1 | IC1.6 93.46,8.31 R21.2 R18.1 | R18.1 87,8.85 D2.A
N$9
  Top 0.254: R9.1 80.28,3 86.33,3 U3.24
N$10
  Top 0.254: MODE_SELECT.2 78.28,8.15 78.81,8.15 81,5.96 81,5 82,4 82.81,4 84.81,6 92,6 93.53,4.47 U3.28
N$11
  Bottom 0.254: LOGO_TWO.4 73.33,19.54 72.8,20.07 72.8,21.08 73.06,21.34 81.51,21.34 LOGO_ONE.2
N$12
  Top 0.254: U1.6 72.91,21.24 72.91,20.59 74.67,18.84 Y1.1 74.67,17.75 75.9,16.53 75.9,14.73 C13.1
N$13  (via drill 0.3)
  Top 0.254: U1.31 82.31,30.31 v83,31 | v87,34 88.08,34 C7.1
  Bottom 0.254: v83,31 86,34 v87,34
N$14  (via drill 0.3)
  Top 0.254: U1.47 70.84,34.69 v70.27,35.27 | v87,37 87.64,37.64 C8.1
  Bottom 0.254: v70.27,35.27 72,37 v87,37
N$15
  Top 0.254: U1.5 72.4,21.25 72.4,17.4 70.97,15.97 Y1.3 69.02,17.81 C12.1
N$16  (via drill 0.3)
  Top 0.254: SW2.2 98.45,33.18 98.05,33.18 95.25,35.98 R5.1 94.33,36 v93,36 | U1.60 68.28,25.31 67.61,25.31 v67,26
  Bottom 0.254: v93,36 93,32 87,26 v67,26
N$17  (via drill 0.3)
  Top 0.152: U1.7 73.34,20.67 74.71,19.3 75.76,19.3 76.25,18.81 v76.29,18.81 | v90,27 90.37,27.37 R4.1 | v96,28 96.2,27.8 SW1.1
  Bottom 0.152: v76.29,18.81 77.1,18 84,18 84.23,18.23 84.23,20.23 90,26 v90,27 91,28 v96,28
N$18
  Top 0.762: R6.2 56,34.09 U2.1 48.46,26.46 47,25 44,25 40.7,21.7 Q1.3
N$19
  Top 0.762: Q1.1 45.3,19.55 R7.1
N$20
  Top 0.254: R13.2 R14.1
N$21
  Bottom 0.254: D2.C 81.15,7 78,7 77,6 77,3 78,2 88.85,2 R21.1 94.3,4.15 R3.2 98.15,5.85 99,5 102,5 103,6 103,25.31 U$1.T_R
N$22  (via drill 0.3)
  Top 0.254: R13.1 R12.2 24.15,28 v28,28 | v34,16 33.91,16.09 U4.4
  Bottom 0.254: v28,28 29,27 29,17 30,16 v34,16
N$23
  Top 1.016: D1.C 18.95,23 C20.2 22.15,17.35 L1.1 25.07,18.57 U4.1
N$24
  Top 1.016: C20.1 24.28,23.43 U4.8
N$25
  Top 0.254: LED2.C 17.65,9 R17.2
N$26  (via drill 0.3)
  Top 0.254: v100,8 v100,10
  Bottom 0.254: IC1.11 96,16.33 97.33,15 99,15 99.81,14.19 IC1.1 99.81,10.19 v100,10 | D3.A v100,8
N$27  (via drill 0.3)
  Top 0.254: v88.02,2.98 98.98,2.98 v99,3
  Bottom 0.254: R18.2 88.02,3.13 v88.02,2.98 | v99,3 99.15,3.15 D3.C
N$28
  Top 0.254: R15.1 30,10.15 30,15 32.63,17.64 U4.3
N$29
  Top 0.254: R15.2 C18.1
N$30  (via drill 0.3)
  Top 0.254: v93,16 v98,16
  Bottom 0.254: R20.1 80.15,16 85,16 | IC1.9 93.46,16.46 v93,16 85,16 | 85,16 85.74,15.26 86,15.26 | v98,16 97.27,16.73 IC1.12
N$31
  Bottom 0.254: R19.1 85,7.85 85,10 88,13 C10.1 89.9,15 94,15 94.09,15.09 94.09,19.38 93.55,19.92 92.93,19.92 92.19,19.18 IC1.8
N$32  (via drill 0.3)
  Top 0.254: U4.6 32.63,24.64 v33,25 | v39,29 R10.2
  Bottom 0.254: v33,25 37,29 v39,29
N$33
  Bottom 0.254: Q2.1 77.2,14.95 R20.2
N$34  (via drill 0.3)
  Top 0.254: R7.2 43.15,21.85 v43,22 | v41,34 42.37,35.37 U2.7
  Bottom 0.254: v43,22 43,32 v41,34
N$35
  Bottom 0.254: R22.2 87.95,14.85 C10.2
N$37
  Top 0.254: R8.2 46.75,30.6 LED1.C
RADIO_AUX
  Top 0.254: U$2.5 64.7,21.25 64.7,24.82 67.69,27.81 U1.55
RADIO_M0  (via drill 0.3)
  Top 0.254: v77,29 v77,27.58 | U1.26 81,27.81 v81.59,27.22
  Bottom 0.254: U$2.1 76.26,29.74 v77,29 | v77,27.58 77.58,27.58 77.93,27.93 80.87,27.93 | 80.87,27.93 81.07,27.73 | v81.59,27.22 80.88,27.93 80.87,27.93
RADIO_M1  (via drill 0.3)
  Top 0.254: U$2.2 64.2,27.2 v65,28 | v81.68,28.32 U1.27
  Bottom 0.254: v65,28 65.34,28.34 78.34,28.34 79,29 81,29 v81.68,28.32
RADIO_RX
  Top 0.254: U1.53 67.18,28.81 U$2.3
RADIO_TX
  Top 0.254: U$2.4 64.06,23.15 64.06,25 67.37,28.31 U1.54
RGB_PWM  (via drill 0.3)
  Top 0.152: U1.61 67.19,24.81 v67,25
  Bottom 0.152: LOGO_ONE.4 86.61,23.61 85.25,22.25 85.25,22.11 84.89,21.75 75.69,21.75 73.26,24.18 72.66,24.18 71.84,25 v67,25
SYS_EN  (via drill 0.3)
  Top 0.254: R16.2 20,31.85 20,29 22,27 29,27 31.15,29.15 R11.1 33.15,32 35,32 36,31 v36,27 | v30.42,16.79 31.37,17.73 U4.2
  Bottom 0.254: v30.42,16.79 30.42,21.42 v36,27 51,12 65.51,12 68.29,14.78 71.49,14.78 73,13.27 Q2.2
V_BAT  (via drill 0.3)
  Top 0.254: C21.2 20.85,26 30,26 | 30,26 33,29 33,29.85 R11.2 | 30,26 31.37,24.64 U4.7 | Q1.4 43,11 | 43,11 43,12 | 43,12 Q1.2 | 52.99,18 J1.1 52.76,12 43,12 | 52.99,18 52.99,19.84 C11.1 59.04,25.89 59.04,35.3 58.4,35.94 55.91,35.94 55.33,35.37 U2.2 | 43,11 40,11 38,13 38,23 35,26 30,26 | 52.99,18 55.2,15.79 65.21,15.79 67,14 v69,14 | v101,15 102,16 104,16 104.98,16.98 U$1.T_L | v85,12 89,12 91,14 v96,14
  Bottom 0.254: v69,14 Q2.3 72,12.9 72,12 73,11 80.85,11 R22.1 84.15,12 v85,12 | IC1.14 102,15.88 102,14 | 102,14 102,10 101,9 97,9 96,10 IC1.4 v96,14 | 102,14 v101,15
VBUS  (via drill 0.3)
  Top 0.254: USB.VBUS 6.59,23.59 10.13,27.13 C1.A 11.79,31.21 v12,31 | v62,38 65,35 v65,34 | v73,35 73.34,34.66 U1.42
  Bottom 0.254: v65,34 66,33 72,33 72,34 v73,35 | v12,31 13.12,31 20.12,38 v62,38

### Text on the board
tPlace: ICE FEILD PROTOBOARD V0.1 / © ICE FEILD LLC AUTHOR CHENGMING ZHANG